# EAGLE schematic new moisture ckt design (EAGLE 9.6.2)
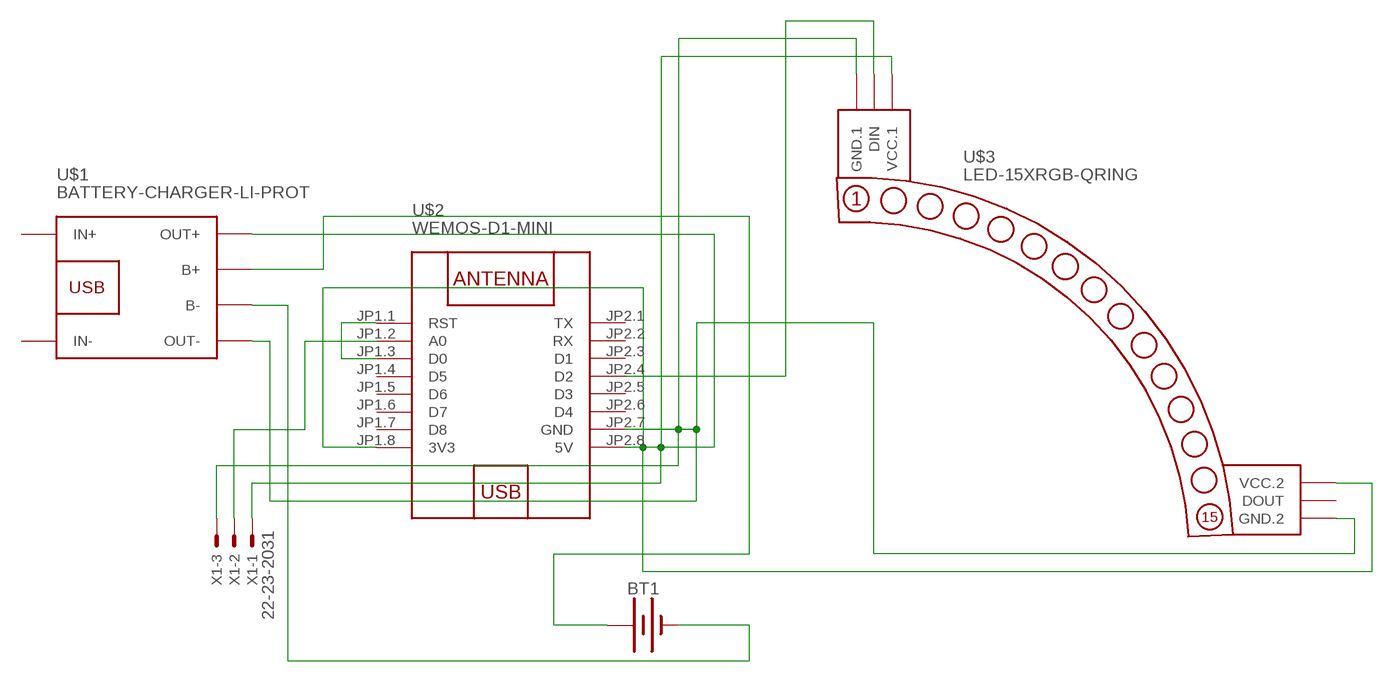
[diagram p0: schematic, sheet 1]

## Parts
BT1  BATTERY-12MM_PTH  [BATTCON_12MM_PTH]
U$1  BATTERY-CHARGER-LI-PROT  [BATTERY-CHARGER-LI-PROT]
U$2  WEMOS-D1-MINI  [WEMOS-D1-MINI]
U$3  LED-15XRGB-QRING  [LED-15XRGB-QRING]
X1  22-23-2031  [22-23-2031]

## Nets
N$1: U$2.JP1.1(RST) U$2.JP1.3(D0)
N$2: U$2.JP1.2(A0) X1.2
N$3: U$1.OUT+ U$2.JP1.8(3V3) U$2.JP2.8(5V) U$3.3(VCC.1) U$3.6(VCC.2) X1.1
N$4: U$1.OUT- U$2.JP2.7(GND) U$3.1(GND.1) U$3.4(GND.2) X1.3
N$6: BT1.GND(-) U$1.B-
N$7: BT1.VCC@1(+) U$1.B+
N$9: U$2.JP2.4(D2) U$3.2(DIN)
Unconnected: U$1.IN+ U$1.IN- U$2.JP1.4(D5) U$2.JP1.5(D6) U$2.JP1.6(D7) U$2.JP1.7(D8) U$2.JP2.1(TX) U$2.JP2.2(RX) U$2.JP2.3(D1) U$2.JP2.5(D3) U$2.JP2.6(D4) U$3.5(DOUT)

## Library data of the parts
BT1 = SparkFun-Batteries:BATTERY: Battery - Single Cell A variety of battery chemistries, sizes, and footprints. Device List: 20MM_PTH - Coin Cell Battery Holder - 20mm (PTH) <https://www.sparkfun.com/products/783> 6.8MM_PTH - Coin Cell Battery Holder - 6.8MM(SMD) <https://www.digikey.com/product-detail/en/seiko-instruments/MS621FE-FL11E/728-1057-ND/1889208?WT.srch=1&gclid=CNOQ5a6LzdQCFZS2wAodXCkE0g> 12MM_SMD - Coin Cell Battery Holder - 12mm (SMD) <https://www.sparkfun.com/products/10592> 12MM_PTH - Coin Cell Battery Holder - 12mm (PTH) <https://www.sparkfun.com/products/7948> 20MM_SMD - 20mm Coin Cell Battery Holder (SMD) (2 legs) Used on the Big Time Watch Kit <https://www.sparkfun.com/products/11734> 20MM_SMD_4LEGS - Coin Cell Battery Holder - 20mm (SMD) <https://www.sparkfun.com/products/11892> 20MM_SMD_4LEGS_OVERPASTE - Coin Cell Battery Holder - 20mm (SMD) <https://www.sparkfun.com/products/11892> (Over-paste on the legs) 24.5MM_PTH - Coin Cell Battery Holder - 24.5mm (PTH) <https://www.sparkfun.com/products/8863> 9V - 9V Battery Holder - PC Mount Used on the SparkFun SparkPunk Sound Kit <https://www.sparkfun.com/products/11177> and SparkFun SparkPunk Sequencer Kit <https://www.sparkfun.com/products/12707> 18650 - Battery Holder - 18650 (PTH) <https://www.sparkfun.com/products/13113> AA - Battery Holder - 1xAA (PTH) <https://www.sparkfun.com/products/7949> AAA - Battery Holder - 1xAAA (PTH) <https://www.sparkfun.com/products/12718> AA_KIT - Battery Holder - 1xAA (PTH) <https://www.sparkfun.com/products/7949> Special kit package - pads only have exposed copper on one side of the board. AAA_KIT - Battery Holder - 1xAAA (PTH) <https://www.sparkfun.com/products/12718> Special kit package - pads only have exposed copper on one side of the board.; PROD_ID: BATT-08315; SF_SKU: PRT-07948
U$1 = diy-modules:BATTERY-CHARGER-LI-PROT: Lithium Battery 5V Charger with protection circuit More details available here: http://www.instructables.com/id/DIY-Lithium-ion-Battery-Charger/step4/TP4056-based-lithium-ion-battery-charger-module/ Click here to find device on ebay.com <http://www.ebay.com/sch/tp4056+charger+usb+protection>
U$2 = diy-modules:WEMOS-D1-MINI: WEMOS D1 mini: Mini Wi-Fi Board based on ESP-8266 device More details can be found here: https://www.wemos.cc/product/d1-mini.html Click here to find device on ebay.com <http://www.ebay.com/sch/wemos+d1+mini+nodemcu>
U$3 = diy-modules:LED-15XRGB-QRING: 15 LEDs RGB Quarter-Ring based on WS2812B More details about controlling WS2812B RGB LEDs are available here: https://learn.sparkfun.com/tutorials/ws2812-breakout-hookup-guide Click here to find device on ebay.com <http://www.ebay.com/sch/ws2812+60+ring> Note: Sold in packs of 4 pieces.
X1 = con-molex:22-23-2031: .100" (2.54mm) Center Header - 3 Pin; MF: MOLEX; MPN: 22-23-2031; OC_FARNELL: 1462950; OC_NEWARK: 30C0862

## Net classes
0 default: width 0.305 mm, drill 0.508 mm, clearance 0.254 mm